# Altium schematic sheet RS232.SchDoc
size A4
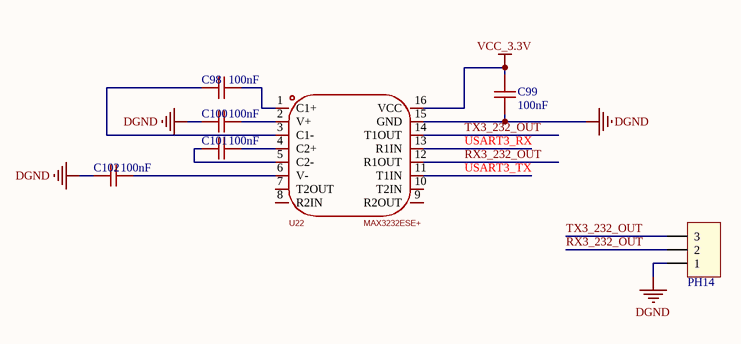
[diagram p0: RS232.SchDoc]

## Parts
C98  100nF  [C0603]
C99  100nF  [C0603]
C100  100nF  [C0603]
C101  100nF  [C0603]
C102  100nF  [C0603]
PH14  PH2.0-3P  [PH2.0-3P 弯针]  (value not drawn)
U22  MAX3232ESE+  [SOIC-16_L9.9-W3.9-P1.27-LS6.0-BL]

## Nets
DGND: C99.1 C100.2 C102.2 PH14.1 U22.15(GND)
VCC_3.3V: C99.2 U22.16(VCC)
RX3_232_OUT: PH14.2 U22.12(R1OUT)
TX3_232_OUT: PH14.3 U22.14(T1OUT)
USART3_RX: U22.13(R1IN)
USART3_TX: U22.11(T1IN)
NetC98_1: C98.1 U22.1(C1+)
NetC98_2: C98.2 U22.3(C1-)
NetC100_1: C100.1 U22.2(V+)
NetC101_1: C101.1 U22.4(C2+)
NetC101_2: C101.2 U22.5(C2-)
NetC102_1: C102.1 U22.6(V-)

Not connected (* = marked no-connect by the designer): U22 7(T2OUT) 8(R2IN) 9(R2OUT) 10(T2IN)

## Library data of the parts
C98-C102 = 100nF/50V,C0603: 贴片电容,X7R; ComponentLink1Description: 供应商链接; ComponentLink1URL: http://www.szlcsc.com/product/details_16531.html
U22 = MAX3232ESE+: Manufacturer: ADI(亚德诺)/MAXIM(美信); Add into BOM: yes; Number of Drivers: 2; Data Rate: 235Kbps; Voltage - Supply: 3V~5.5V; ESD Protect: ±15kV; charge pump: 有; Symbol: MAX3232ESE+; Device: MAX3232ESE+; LCSC Part Name: MAX3222/MAX3232/MAX3237/MAX3241 3.0V 至 5.5V，低功耗，最高 1Mbps，真正的 RS-232 收发器使用四个 0.1uF 外部电容; Supplier Part: C143435; Manufacturer Part: MAX3232ESE+; Supplier Footprint: SOIC-16; JLCPCB Part Class: Extended Part; Datasheet: https://item.szlcsc.com/datasheet/MAX3232ESE%252B/154766.html; Supplier: LCSC; Convert to PCB: yes; Type: 收发器; Number of Receivers: 2; Operating Temperature: -40℃~+85℃